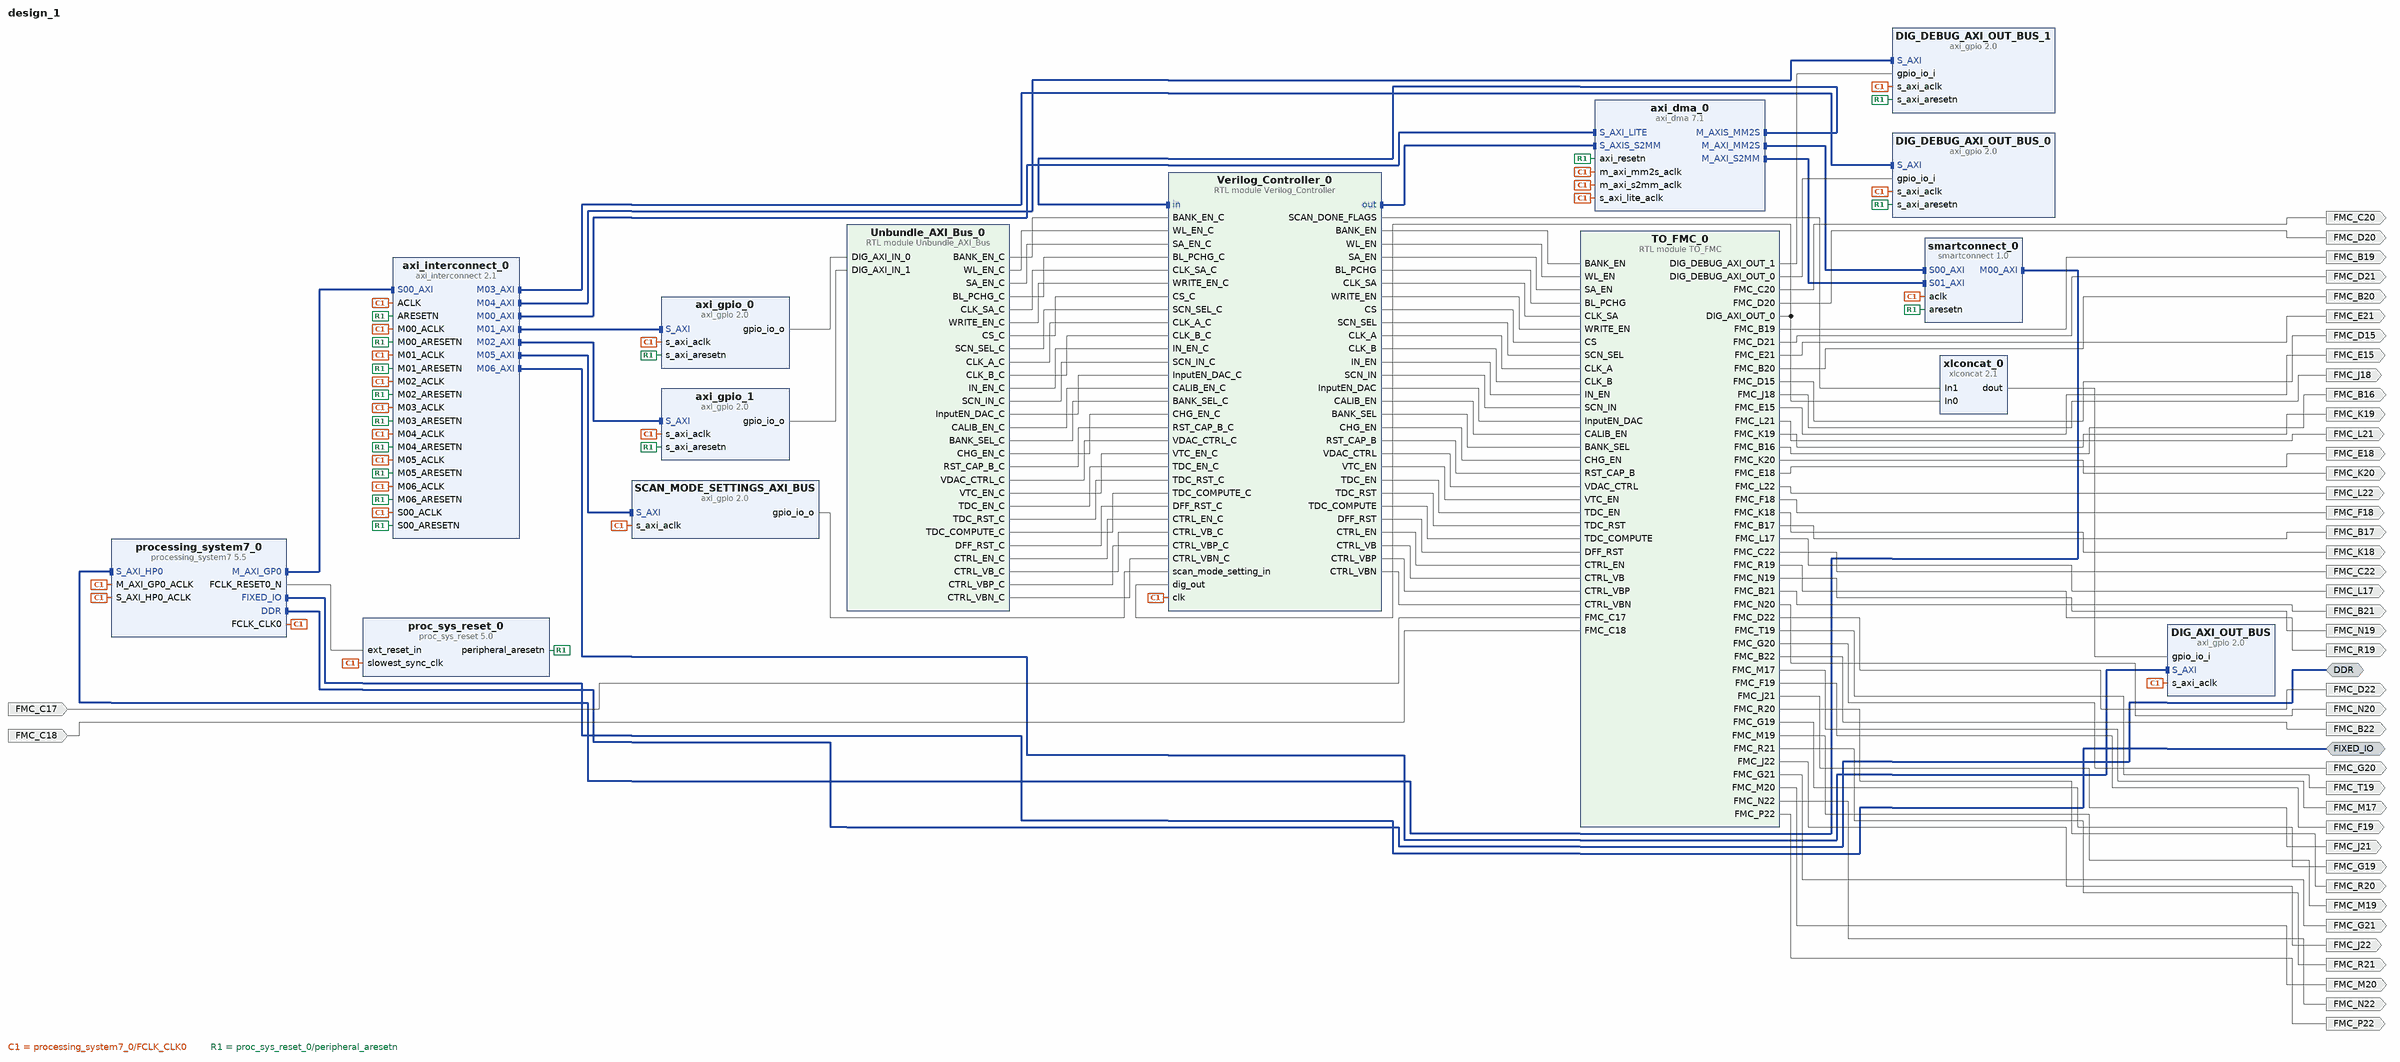
[diagram p0: block diagram of the top level]
# Vivado block design design_1, xc7z020clg484-1, Vivado 2018.3
create_bd_design design_1

create_bd_intf_port -mode Master -vlnv xilinx.com:interface:ddrx_rtl:1.0 DDR
create_bd_intf_port -mode Master -vlnv xilinx.com:display_processing_system7:fixedio_rtl:1.0 FIXED_IO
create_bd_port -dir O FMC_L21
create_bd_port -dir O FMC_C20
create_bd_port -dir O FMC_L22
create_bd_port -dir O FMC_R19
create_bd_port -dir O FMC_T19
create_bd_port -dir O FMC_K19
create_bd_port -dir O FMC_K20
create_bd_port -dir O FMC_D20
create_bd_port -dir O FMC_E21
create_bd_port -dir O FMC_D21
create_bd_port -dir O FMC_N19
create_bd_port -dir O FMC_N20
create_bd_port -dir O FMC_J18
create_bd_port -dir O FMC_K18
create_bd_port -dir O FMC_R20
create_bd_port -dir O FMC_R21
create_bd_port -dir O FMC_L17
create_bd_port -dir O FMC_M17
create_bd_port -dir O FMC_B19
create_bd_port -dir O FMC_B20
create_bd_port -dir O FMC_E15
create_bd_port -dir O FMC_D15
create_bd_port -dir O FMC_F18
create_bd_port -dir O FMC_E18
create_bd_port -dir O FMC_M19
create_bd_port -dir O FMC_M20
create_bd_port -dir O FMC_N22
create_bd_port -dir O FMC_P22
create_bd_port -dir O FMC_J21
create_bd_port -dir O FMC_J22
create_bd_port -dir O FMC_G20
create_bd_port -dir O FMC_G21
create_bd_port -dir O FMC_G19
create_bd_port -dir O FMC_F19
create_bd_port -dir O FMC_D22
create_bd_port -dir O FMC_C22
create_bd_port -dir O FMC_B16
create_bd_port -dir O FMC_B17
create_bd_port -dir O FMC_B21
create_bd_port -dir O FMC_B22
create_bd_port -dir I FMC_C17
create_bd_port -dir I FMC_C18

create_bd_cell -type ip -vlnv xilinx.com:ip:processing_system7:5.5 processing_system7_0
set_property -dict [list \
  CONFIG.PCW_APU_PERIPHERAL_FREQMHZ 666.666667 \
  CONFIG.PCW_ENET0_ENET0_IO {MIO 16 .. 27} \
  CONFIG.PCW_ENET0_GRP_MDIO_ENABLE 1 \
  CONFIG.PCW_ENET0_GRP_MDIO_IO {MIO 52 .. 53} \
  CONFIG.PCW_ENET0_PERIPHERAL_ENABLE 1 \
  CONFIG.PCW_ENET0_RESET_ENABLE 0 \
  CONFIG.PCW_ENET_RESET_ENABLE 1 \
  CONFIG.PCW_ENET_RESET_SELECT {Share reset pin} \
  CONFIG.PCW_FPGA0_PERIPHERAL_FREQMHZ 100.000000 \
  CONFIG.PCW_FPGA1_PERIPHERAL_FREQMHZ 150.000000 \
  CONFIG.PCW_GPIO_MIO_GPIO_ENABLE 1 \
  CONFIG.PCW_GPIO_MIO_GPIO_IO MIO \
  CONFIG.PCW_I2C_RESET_ENABLE 1 \
  CONFIG.PCW_PRESET_BANK1_VOLTAGE {LVCMOS 1.8V} \
  CONFIG.PCW_QSPI_GRP_SINGLE_SS_ENABLE 1 \
  CONFIG.PCW_QSPI_GRP_SINGLE_SS_IO {MIO 1 .. 6} \
  CONFIG.PCW_QSPI_PERIPHERAL_ENABLE 1 \
  CONFIG.PCW_QSPI_QSPI_IO {MIO 1 .. 6} \
  CONFIG.PCW_SD0_GRP_CD_ENABLE 1 \
  CONFIG.PCW_SD0_GRP_CD_IO {MIO 47} \
  CONFIG.PCW_SD0_GRP_WP_ENABLE 1 \
  CONFIG.PCW_SD0_GRP_WP_IO {MIO 46} \
  CONFIG.PCW_SD0_PERIPHERAL_ENABLE 1 \
  CONFIG.PCW_SD0_SD0_IO {MIO 40 .. 45} \
  CONFIG.PCW_SDIO_PERIPHERAL_FREQMHZ 50 \
  CONFIG.PCW_SINGLE_QSPI_DATA_MODE x4 \
  CONFIG.PCW_TTC0_PERIPHERAL_ENABLE 1 \
  CONFIG.PCW_TTC0_TTC0_IO EMIO \
  CONFIG.PCW_UART1_PERIPHERAL_ENABLE 1 \
  CONFIG.PCW_UART1_UART1_IO {MIO 48 .. 49} \
  CONFIG.PCW_UART_PERIPHERAL_FREQMHZ 50 \
  CONFIG.PCW_UIPARAM_DDR_FREQ_MHZ 533.333313 \
  CONFIG.PCW_UIPARAM_DDR_PARTNO {MT41J128M16 HA-15E} \
  CONFIG.PCW_UIPARAM_GENERATE_SUMMARY NONE \
  CONFIG.PCW_USB0_PERIPHERAL_ENABLE 1 \
  CONFIG.PCW_USB0_RESET_ENABLE 0 \
  CONFIG.PCW_USB0_USB0_IO {MIO 28 .. 39} \
  CONFIG.PCW_USB_RESET_ENABLE 1 \
  CONFIG.PCW_USB_RESET_SELECT {Share reset pin} \
  CONFIG.PCW_USE_S_AXI_HP0 1 \
  CONFIG.preset ZedBoard \
] [get_bd_cells processing_system7_0]
# 225 more settings of processing_system7_0 are not shown: defaults, MIO pin electricals, DDR timing, and values the tool derives
create_bd_cell -type ip -vlnv xilinx.com:ip:proc_sys_reset:5.0 proc_sys_reset_0
create_bd_cell -type ip -vlnv xilinx.com:ip:axi_interconnect:2.1 axi_interconnect_0
set_property -dict {CONFIG.NUM_MI 7} [get_bd_cells axi_interconnect_0]
create_bd_cell -type module -reference Unbundle_AXI_Bus Unbundle_AXI_Bus_0
create_bd_cell -type ip -vlnv xilinx.com:ip:axi_gpio:2.0 axi_gpio_0
set_property -dict {CONFIG.C_ALL_OUTPUTS 1 CONFIG.C_INTERRUPT_PRESENT 0} [get_bd_cells axi_gpio_0]
create_bd_cell -type ip -vlnv xilinx.com:ip:axi_dma:7.1 axi_dma_0
set_property -dict {CONFIG.c_include_sg 0} [get_bd_cells axi_dma_0]
create_bd_cell -type ip -vlnv xilinx.com:ip:axi_gpio:2.0 axi_gpio_1
set_property -dict {CONFIG.C_ALL_OUTPUTS 1 CONFIG.C_GPIO_WIDTH 2} [get_bd_cells axi_gpio_1]
create_bd_cell -type ip -vlnv xilinx.com:ip:smartconnect:1.0 smartconnect_0
create_bd_cell -type ip -vlnv xilinx.com:ip:axi_gpio:2.0 DIG_DEBUG_AXI_OUT_BUS_0
set_property -dict {CONFIG.C_ALL_INPUTS 1 CONFIG.C_INTERRUPT_PRESENT 0 CONFIG.C_IS_DUAL 0} [get_bd_cells DIG_DEBUG_AXI_OUT_BUS_0]
create_bd_cell -type module -reference TO_FMC TO_FMC_0
create_bd_cell -type ip -vlnv xilinx.com:ip:axi_gpio:2.0 DIG_DEBUG_AXI_OUT_BUS_1
set_property -dict [list \
  CONFIG.C_ALL_INPUTS 1 \
  CONFIG.C_GPIO_WIDTH 2 \
  CONFIG.C_INTERRUPT_PRESENT 0 \
  CONFIG.C_IS_DUAL 0 \
] [get_bd_cells DIG_DEBUG_AXI_OUT_BUS_1]
create_bd_cell -type ip -vlnv xilinx.com:ip:xlconcat:2.1 xlconcat_0
set_property -dict {CONFIG.IN0_WIDTH 2 CONFIG.IN1_WIDTH 4} [get_bd_cells xlconcat_0]
create_bd_cell -type ip -vlnv xilinx.com:ip:axi_gpio:2.0 SCAN_MODE_SETTINGS_AXI_BUS
set_property -dict {CONFIG.C_ALL_OUTPUTS 1 CONFIG.C_INTERRUPT_PRESENT 0} [get_bd_cells SCAN_MODE_SETTINGS_AXI_BUS]
create_bd_cell -type ip -vlnv xilinx.com:ip:axi_gpio:2.0 DIG_AXI_OUT_BUS
set_property -dict [list \
  CONFIG.C_ALL_INPUTS 1 \
  CONFIG.C_GPIO_WIDTH 6 \
  CONFIG.C_INTERRUPT_PRESENT 0 \
  CONFIG.C_IS_DUAL 0 \
] [get_bd_cells DIG_AXI_OUT_BUS]
create_bd_cell -type module -reference Verilog_Controller Verilog_Controller_0

# ---- connections ----

connect_bd_intf_net [get_bd_intf_pins axi_dma_0/S_AXIS_S2MM] [get_bd_intf_pins Verilog_Controller_0/out]
connect_bd_intf_net [get_bd_intf_pins axi_interconnect_0/M03_AXI] [get_bd_intf_pins DIG_DEBUG_AXI_OUT_BUS_0/S_AXI]
connect_bd_intf_net [get_bd_intf_ports FIXED_IO] [get_bd_intf_pins processing_system7_0/FIXED_IO]
connect_bd_intf_net [get_bd_intf_pins processing_system7_0/M_AXI_GP0] [get_bd_intf_pins axi_interconnect_0/S00_AXI]
connect_bd_intf_net [get_bd_intf_pins axi_dma_0/M_AXI_MM2S] [get_bd_intf_pins smartconnect_0/S00_AXI]
connect_bd_intf_net [get_bd_intf_pins axi_interconnect_0/M06_AXI] [get_bd_intf_pins DIG_AXI_OUT_BUS/S_AXI]
connect_bd_intf_net [get_bd_intf_pins axi_interconnect_0/M04_AXI] [get_bd_intf_pins DIG_DEBUG_AXI_OUT_BUS_1/S_AXI]
connect_bd_intf_net [get_bd_intf_pins axi_interconnect_0/M05_AXI] [get_bd_intf_pins SCAN_MODE_SETTINGS_AXI_BUS/S_AXI]
connect_bd_intf_net [get_bd_intf_pins axi_interconnect_0/M02_AXI] [get_bd_intf_pins axi_gpio_1/S_AXI]
connect_bd_intf_net [get_bd_intf_pins axi_interconnect_0/M00_AXI] [get_bd_intf_pins axi_dma_0/S_AXI_LITE]
connect_bd_intf_net [get_bd_intf_pins axi_interconnect_0/M01_AXI] [get_bd_intf_pins axi_gpio_0/S_AXI]
connect_bd_intf_net [get_bd_intf_ports DDR] [get_bd_intf_pins processing_system7_0/DDR]
connect_bd_intf_net [get_bd_intf_pins smartconnect_0/M00_AXI] [get_bd_intf_pins processing_system7_0/S_AXI_HP0]
connect_bd_intf_net [get_bd_intf_pins axi_dma_0/M_AXIS_MM2S] [get_bd_intf_pins Verilog_Controller_0/in]
connect_bd_intf_net [get_bd_intf_pins axi_dma_0/M_AXI_S2MM] [get_bd_intf_pins smartconnect_0/S01_AXI]
connect_bd_net [get_bd_pins processing_system7_0/FCLK_CLK0] \
  [get_bd_pins proc_sys_reset_0/slowest_sync_clk] [get_bd_pins axi_interconnect_0/ACLK] [get_bd_pins axi_gpio_0/s_axi_aclk] \
  [get_bd_pins axi_gpio_1/s_axi_aclk] [get_bd_pins smartconnect_0/aclk] [get_bd_pins processing_system7_0/M_AXI_GP0_ACLK] \
  [get_bd_pins processing_system7_0/S_AXI_HP0_ACLK] [get_bd_pins axi_dma_0/m_axi_s2mm_aclk] \
  [get_bd_pins axi_dma_0/m_axi_mm2s_aclk] [get_bd_pins axi_dma_0/s_axi_lite_aclk] [get_bd_pins axi_interconnect_0/S00_ACLK] \
  [get_bd_pins axi_interconnect_0/M00_ACLK] [get_bd_pins axi_interconnect_0/M01_ACLK] \
  [get_bd_pins axi_interconnect_0/M02_ACLK] [get_bd_pins axi_interconnect_0/M03_ACLK] \
  [get_bd_pins axi_interconnect_0/M04_ACLK] [get_bd_pins axi_interconnect_0/M05_ACLK] \
  [get_bd_pins axi_interconnect_0/M06_ACLK] [get_bd_pins DIG_DEBUG_AXI_OUT_BUS_0/s_axi_aclk] \
  [get_bd_pins DIG_DEBUG_AXI_OUT_BUS_1/s_axi_aclk] [get_bd_pins SCAN_MODE_SETTINGS_AXI_BUS/s_axi_aclk] \
  [get_bd_pins DIG_AXI_OUT_BUS/s_axi_aclk] [get_bd_pins Verilog_Controller_0/clk]
connect_bd_net [get_bd_pins processing_system7_0/FCLK_RESET0_N] [get_bd_pins proc_sys_reset_0/ext_reset_in]
connect_bd_net [get_bd_pins proc_sys_reset_0/peripheral_aresetn] \
  [get_bd_pins axi_interconnect_0/ARESETN] [get_bd_pins axi_gpio_0/s_axi_aresetn] [get_bd_pins axi_gpio_1/s_axi_aresetn] \
  [get_bd_pins axi_dma_0/axi_resetn] [get_bd_pins smartconnect_0/aresetn] [get_bd_pins DIG_DEBUG_AXI_OUT_BUS_0/s_axi_aresetn] \
  [get_bd_pins DIG_DEBUG_AXI_OUT_BUS_1/s_axi_aresetn] [get_bd_pins axi_interconnect_0/S00_ARESETN] \
  [get_bd_pins axi_interconnect_0/M00_ARESETN] [get_bd_pins axi_interconnect_0/M01_ARESETN] \
  [get_bd_pins axi_interconnect_0/M02_ARESETN] [get_bd_pins axi_interconnect_0/M03_ARESETN] \
  [get_bd_pins axi_interconnect_0/M04_ARESETN] [get_bd_pins axi_interconnect_0/M05_ARESETN] \
  [get_bd_pins axi_interconnect_0/M06_ARESETN]
connect_bd_net [get_bd_pins Unbundle_AXI_Bus_0/BANK_EN_C] [get_bd_pins Verilog_Controller_0/BANK_EN_C]
connect_bd_net [get_bd_pins Unbundle_AXI_Bus_0/WL_EN_C] [get_bd_pins Verilog_Controller_0/WL_EN_C]
connect_bd_net [get_bd_pins Unbundle_AXI_Bus_0/SA_EN_C] [get_bd_pins Verilog_Controller_0/SA_EN_C]
connect_bd_net [get_bd_pins Unbundle_AXI_Bus_0/BL_PCHG_C] [get_bd_pins Verilog_Controller_0/BL_PCHG_C]
connect_bd_net [get_bd_pins Unbundle_AXI_Bus_0/CLK_SA_C] [get_bd_pins Verilog_Controller_0/CLK_SA_C]
connect_bd_net [get_bd_pins Unbundle_AXI_Bus_0/WRITE_EN_C] [get_bd_pins Verilog_Controller_0/WRITE_EN_C]
connect_bd_net [get_bd_pins Unbundle_AXI_Bus_0/CS_C] [get_bd_pins Verilog_Controller_0/CS_C]
connect_bd_net [get_bd_pins Unbundle_AXI_Bus_0/SCN_SEL_C] [get_bd_pins Verilog_Controller_0/SCN_SEL_C]
connect_bd_net [get_bd_pins Unbundle_AXI_Bus_0/CLK_A_C] [get_bd_pins Verilog_Controller_0/CLK_A_C]
connect_bd_net [get_bd_pins Unbundle_AXI_Bus_0/CLK_B_C] [get_bd_pins Verilog_Controller_0/CLK_B_C]
connect_bd_net [get_bd_pins Unbundle_AXI_Bus_0/IN_EN_C] [get_bd_pins Verilog_Controller_0/IN_EN_C]
connect_bd_net [get_bd_pins Unbundle_AXI_Bus_0/SCN_IN_C] [get_bd_pins Verilog_Controller_0/SCN_IN_C]
connect_bd_net [get_bd_pins Unbundle_AXI_Bus_0/InputEN_DAC_C] [get_bd_pins Verilog_Controller_0/InputEN_DAC_C]
connect_bd_net [get_bd_pins Unbundle_AXI_Bus_0/CALIB_EN_C] [get_bd_pins Verilog_Controller_0/CALIB_EN_C]
connect_bd_net [get_bd_pins Unbundle_AXI_Bus_0/BANK_SEL_C] [get_bd_pins Verilog_Controller_0/BANK_SEL_C]
connect_bd_net [get_bd_pins Unbundle_AXI_Bus_0/CHG_EN_C] [get_bd_pins Verilog_Controller_0/CHG_EN_C]
connect_bd_net [get_bd_pins Unbundle_AXI_Bus_0/RST_CAP_B_C] [get_bd_pins Verilog_Controller_0/RST_CAP_B_C]
connect_bd_net [get_bd_pins Unbundle_AXI_Bus_0/VDAC_CTRL_C] [get_bd_pins Verilog_Controller_0/VDAC_CTRL_C]
connect_bd_net [get_bd_pins Unbundle_AXI_Bus_0/VTC_EN_C] [get_bd_pins Verilog_Controller_0/VTC_EN_C]
connect_bd_net [get_bd_pins Unbundle_AXI_Bus_0/TDC_EN_C] [get_bd_pins Verilog_Controller_0/TDC_EN_C]
connect_bd_net [get_bd_pins Unbundle_AXI_Bus_0/TDC_RST_C] [get_bd_pins Verilog_Controller_0/TDC_RST_C]
connect_bd_net [get_bd_pins Unbundle_AXI_Bus_0/TDC_COMPUTE_C] [get_bd_pins Verilog_Controller_0/TDC_COMPUTE_C]
connect_bd_net [get_bd_pins Unbundle_AXI_Bus_0/DFF_RST_C] [get_bd_pins Verilog_Controller_0/DFF_RST_C]
connect_bd_net [get_bd_pins Unbundle_AXI_Bus_0/CTRL_EN_C] [get_bd_pins Verilog_Controller_0/CTRL_EN_C]
connect_bd_net [get_bd_pins Unbundle_AXI_Bus_0/CTRL_VB_C] [get_bd_pins Verilog_Controller_0/CTRL_VB_C]
connect_bd_net [get_bd_pins Unbundle_AXI_Bus_0/CTRL_VBP_C] [get_bd_pins Verilog_Controller_0/CTRL_VBP_C]
connect_bd_net [get_bd_pins Unbundle_AXI_Bus_0/CTRL_VBN_C] [get_bd_pins Verilog_Controller_0/CTRL_VBN_C]
connect_bd_net [get_bd_pins axi_gpio_0/gpio_io_o] [get_bd_pins Unbundle_AXI_Bus_0/DIG_AXI_IN_0]
connect_bd_net [get_bd_pins axi_gpio_1/gpio_io_o] [get_bd_pins Unbundle_AXI_Bus_0/DIG_AXI_IN_1]
connect_bd_net [get_bd_pins Verilog_Controller_0/BANK_EN] [get_bd_pins TO_FMC_0/BANK_EN]
connect_bd_net [get_bd_pins Verilog_Controller_0/WL_EN] [get_bd_pins TO_FMC_0/WL_EN]
connect_bd_net [get_bd_pins Verilog_Controller_0/SA_EN] [get_bd_pins TO_FMC_0/SA_EN]
connect_bd_net [get_bd_pins Verilog_Controller_0/BL_PCHG] [get_bd_pins TO_FMC_0/BL_PCHG]
connect_bd_net [get_bd_pins Verilog_Controller_0/CLK_SA] [get_bd_pins TO_FMC_0/CLK_SA]
connect_bd_net [get_bd_pins Verilog_Controller_0/WRITE_EN] [get_bd_pins TO_FMC_0/WRITE_EN]
connect_bd_net [get_bd_pins Verilog_Controller_0/CS] [get_bd_pins TO_FMC_0/CS]
connect_bd_net [get_bd_pins Verilog_Controller_0/SCN_SEL] [get_bd_pins TO_FMC_0/SCN_SEL]
connect_bd_net [get_bd_pins Verilog_Controller_0/CLK_A] [get_bd_pins TO_FMC_0/CLK_A]
connect_bd_net [get_bd_pins Verilog_Controller_0/CLK_B] [get_bd_pins TO_FMC_0/CLK_B]
connect_bd_net [get_bd_pins Verilog_Controller_0/IN_EN] [get_bd_pins TO_FMC_0/IN_EN]
connect_bd_net [get_bd_pins Verilog_Controller_0/SCN_IN] [get_bd_pins TO_FMC_0/SCN_IN]
connect_bd_net [get_bd_pins Verilog_Controller_0/InputEN_DAC] [get_bd_pins TO_FMC_0/InputEN_DAC]
connect_bd_net [get_bd_pins Verilog_Controller_0/CALIB_EN] [get_bd_pins TO_FMC_0/CALIB_EN]
connect_bd_net [get_bd_pins Verilog_Controller_0/BANK_SEL] [get_bd_pins TO_FMC_0/BANK_SEL]
connect_bd_net [get_bd_pins Verilog_Controller_0/CHG_EN] [get_bd_pins TO_FMC_0/CHG_EN]
connect_bd_net [get_bd_pins Verilog_Controller_0/RST_CAP_B] [get_bd_pins TO_FMC_0/RST_CAP_B]
connect_bd_net [get_bd_pins Verilog_Controller_0/VDAC_CTRL] [get_bd_pins TO_FMC_0/VDAC_CTRL]
connect_bd_net [get_bd_pins Verilog_Controller_0/VTC_EN] [get_bd_pins TO_FMC_0/VTC_EN]
connect_bd_net [get_bd_pins Verilog_Controller_0/TDC_EN] [get_bd_pins TO_FMC_0/TDC_EN]
connect_bd_net [get_bd_pins Verilog_Controller_0/TDC_RST] [get_bd_pins TO_FMC_0/TDC_RST]
connect_bd_net [get_bd_pins Verilog_Controller_0/TDC_COMPUTE] [get_bd_pins TO_FMC_0/TDC_COMPUTE]
connect_bd_net [get_bd_pins Verilog_Controller_0/DFF_RST] [get_bd_pins TO_FMC_0/DFF_RST]
connect_bd_net [get_bd_pins Verilog_Controller_0/CTRL_EN] [get_bd_pins TO_FMC_0/CTRL_EN]
connect_bd_net [get_bd_pins Verilog_Controller_0/CTRL_VB] [get_bd_pins TO_FMC_0/CTRL_VB]
connect_bd_net [get_bd_pins Verilog_Controller_0/CTRL_VBP] [get_bd_pins TO_FMC_0/CTRL_VBP]
connect_bd_net [get_bd_pins Verilog_Controller_0/CTRL_VBN] [get_bd_pins TO_FMC_0/CTRL_VBN]
connect_bd_net [get_bd_pins TO_FMC_0/FMC_L21] [get_bd_ports FMC_L21]
connect_bd_net [get_bd_pins TO_FMC_0/FMC_C20] [get_bd_ports FMC_C20]
connect_bd_net [get_bd_pins TO_FMC_0/FMC_L22] [get_bd_ports FMC_L22]
connect_bd_net [get_bd_pins TO_FMC_0/FMC_R19] [get_bd_ports FMC_R19]
connect_bd_net [get_bd_pins TO_FMC_0/FMC_T19] [get_bd_ports FMC_T19]
connect_bd_net [get_bd_pins TO_FMC_0/FMC_K19] [get_bd_ports FMC_K19]
connect_bd_net [get_bd_pins TO_FMC_0/FMC_K20] [get_bd_ports FMC_K20]
connect_bd_net [get_bd_pins TO_FMC_0/FMC_D20] [get_bd_ports FMC_D20]
connect_bd_net [get_bd_pins TO_FMC_0/FMC_E21] [get_bd_ports FMC_E21]
connect_bd_net [get_bd_pins TO_FMC_0/FMC_D21] [get_bd_ports FMC_D21]
connect_bd_net [get_bd_pins TO_FMC_0/FMC_N19] [get_bd_ports FMC_N19]
connect_bd_net [get_bd_pins TO_FMC_0/FMC_N20] [get_bd_ports FMC_N20]
connect_bd_net [get_bd_pins TO_FMC_0/FMC_J18] [get_bd_ports FMC_J18]
connect_bd_net [get_bd_pins TO_FMC_0/FMC_K18] [get_bd_ports FMC_K18]
connect_bd_net [get_bd_pins TO_FMC_0/FMC_R20] [get_bd_ports FMC_R20]
connect_bd_net [get_bd_pins TO_FMC_0/FMC_R21] [get_bd_ports FMC_R21]
connect_bd_net [get_bd_pins TO_FMC_0/FMC_L17] [get_bd_ports FMC_L17]
connect_bd_net [get_bd_pins TO_FMC_0/FMC_M17] [get_bd_ports FMC_M17]
connect_bd_net [get_bd_pins TO_FMC_0/FMC_B19] [get_bd_ports FMC_B19]
connect_bd_net [get_bd_pins TO_FMC_0/FMC_B20] [get_bd_ports FMC_B20]
connect_bd_net [get_bd_pins TO_FMC_0/FMC_E15] [get_bd_ports FMC_E15]
connect_bd_net [get_bd_pins TO_FMC_0/FMC_D15] [get_bd_ports FMC_D15]
connect_bd_net [get_bd_pins TO_FMC_0/FMC_F18] [get_bd_ports FMC_F18]
connect_bd_net [get_bd_pins TO_FMC_0/FMC_E18] [get_bd_ports FMC_E18]
connect_bd_net [get_bd_pins TO_FMC_0/FMC_M19] [get_bd_ports FMC_M19]
connect_bd_net [get_bd_pins TO_FMC_0/FMC_M20] [get_bd_ports FMC_M20]
connect_bd_net [get_bd_pins TO_FMC_0/FMC_N22] [get_bd_ports FMC_N22]
connect_bd_net [get_bd_pins TO_FMC_0/FMC_P22] [get_bd_ports FMC_P22]
connect_bd_net [get_bd_pins TO_FMC_0/FMC_J21] [get_bd_ports FMC_J21]
connect_bd_net [get_bd_pins TO_FMC_0/FMC_J22] [get_bd_ports FMC_J22]
connect_bd_net [get_bd_pins TO_FMC_0/FMC_G20] [get_bd_ports FMC_G20]
connect_bd_net [get_bd_pins TO_FMC_0/FMC_G21] [get_bd_ports FMC_G21]
connect_bd_net [get_bd_pins TO_FMC_0/FMC_G19] [get_bd_ports FMC_G19]
connect_bd_net [get_bd_pins TO_FMC_0/FMC_F19] [get_bd_ports FMC_F19]
connect_bd_net [get_bd_pins TO_FMC_0/FMC_D22] [get_bd_ports FMC_D22]
connect_bd_net [get_bd_pins TO_FMC_0/FMC_C22] [get_bd_ports FMC_C22]
connect_bd_net [get_bd_pins TO_FMC_0/FMC_B16] [get_bd_ports FMC_B16]
connect_bd_net [get_bd_pins TO_FMC_0/FMC_B17] [get_bd_ports FMC_B17]
connect_bd_net [get_bd_pins TO_FMC_0/FMC_B21] [get_bd_ports FMC_B21]
connect_bd_net [get_bd_pins TO_FMC_0/FMC_B22] [get_bd_ports FMC_B22]
connect_bd_net [get_bd_pins TO_FMC_0/DIG_DEBUG_AXI_OUT_1] [get_bd_pins DIG_DEBUG_AXI_OUT_BUS_1/gpio_io_i]
connect_bd_net [get_bd_pins TO_FMC_0/DIG_DEBUG_AXI_OUT_0] [get_bd_pins DIG_DEBUG_AXI_OUT_BUS_0/gpio_io_i]
connect_bd_net -net FMC_C17_1 [get_bd_ports FMC_C17] [get_bd_pins TO_FMC_0/FMC_C17]
connect_bd_net -net FMC_C18_1 [get_bd_ports FMC_C18] [get_bd_pins TO_FMC_0/FMC_C18]
connect_bd_net [get_bd_pins TO_FMC_0/DIG_AXI_OUT_0] [get_bd_pins xlconcat_0/In0] [get_bd_pins Verilog_Controller_0/dig_out]
connect_bd_net [get_bd_pins Verilog_Controller_0/SCAN_DONE_FLAGS] [get_bd_pins xlconcat_0/In1]
connect_bd_net -net axi_gpio_4_gpio_io_o [get_bd_pins SCAN_MODE_SETTINGS_AXI_BUS/gpio_io_o] [get_bd_pins Verilog_Controller_0/scan_mode_setting_in]
connect_bd_net [get_bd_pins xlconcat_0/dout] [get_bd_pins DIG_AXI_OUT_BUS/gpio_io_i]

# ---- address map ----
assign_bd_address -offset 0x00000000 -range 512M -target_address_space [get_bd_addr_spaces axi_dma_0/Data_MM2S] [get_bd_addr_segs processing_system7_0/S_AXI_HP0/HP0_DDR_LOWOCM]
assign_bd_address -offset 0x00000000 -range 512M -target_address_space [get_bd_addr_spaces axi_dma_0/Data_S2MM] [get_bd_addr_segs processing_system7_0/S_AXI_HP0/HP0_DDR_LOWOCM]
assign_bd_address -offset 0x40400000 -range 64K -target_address_space [get_bd_addr_spaces processing_system7_0/Data] [get_bd_addr_segs axi_dma_0/S_AXI_LITE/Reg]
assign_bd_address -offset 0x41200000 -range 64K -target_address_space [get_bd_addr_spaces processing_system7_0/Data] [get_bd_addr_segs DIG_AXI_OUT_BUS/S_AXI/Reg]
assign_bd_address -offset 0x41210000 -range 64K -target_address_space [get_bd_addr_spaces processing_system7_0/Data] [get_bd_addr_segs DIG_DEBUG_AXI_OUT_BUS_0/S_AXI/Reg]
assign_bd_address -offset 0x41220000 -range 64K -target_address_space [get_bd_addr_spaces processing_system7_0/Data] [get_bd_addr_segs DIG_DEBUG_AXI_OUT_BUS_1/S_AXI/Reg]
assign_bd_address -offset 0x41230000 -range 64K -target_address_space [get_bd_addr_spaces processing_system7_0/Data] [get_bd_addr_segs SCAN_MODE_SETTINGS_AXI_BUS/S_AXI/Reg]
assign_bd_address -offset 0x41240000 -range 64K -target_address_space [get_bd_addr_spaces processing_system7_0/Data] [get_bd_addr_segs axi_gpio_0/S_AXI/Reg]
assign_bd_address -offset 0x41250000 -range 64K -target_address_space [get_bd_addr_spaces processing_system7_0/Data] [get_bd_addr_segs axi_gpio_1/S_AXI/Reg]

validate_bd_design
save_bd_design
